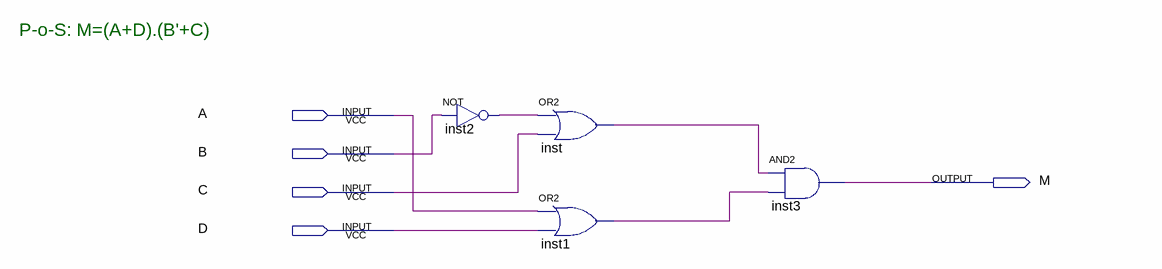
[diagram p0: schematic sheet]
// Quartus schematic MajakEA.bdf as structural Verilog: 4 symbols, 5 pins
module MajakEA (
  input  A,
  input  B,
  input  C,
  input  D,
  output M
);

  wire inst1_out, inst2_out, inst_out;

  not inst2 (inst2_out, B);
  or inst (inst_out, inst2_out, C);
  or inst1 (inst1_out, A, D);
  and inst3 (M, inst_out, inst1_out);

  // Notes on the sheet:
  //   P-o-S: M=(A+D).(B'+C)
endmodule
